# EasyEDA schematic SCH_电工电子实习_2022-11-09.json
TITLE: 原理图; REV: 1.0; Date: 2022-11-9; Sheet: 1/1; Drawn By: 物联214柳栓柱; Company: Your Company
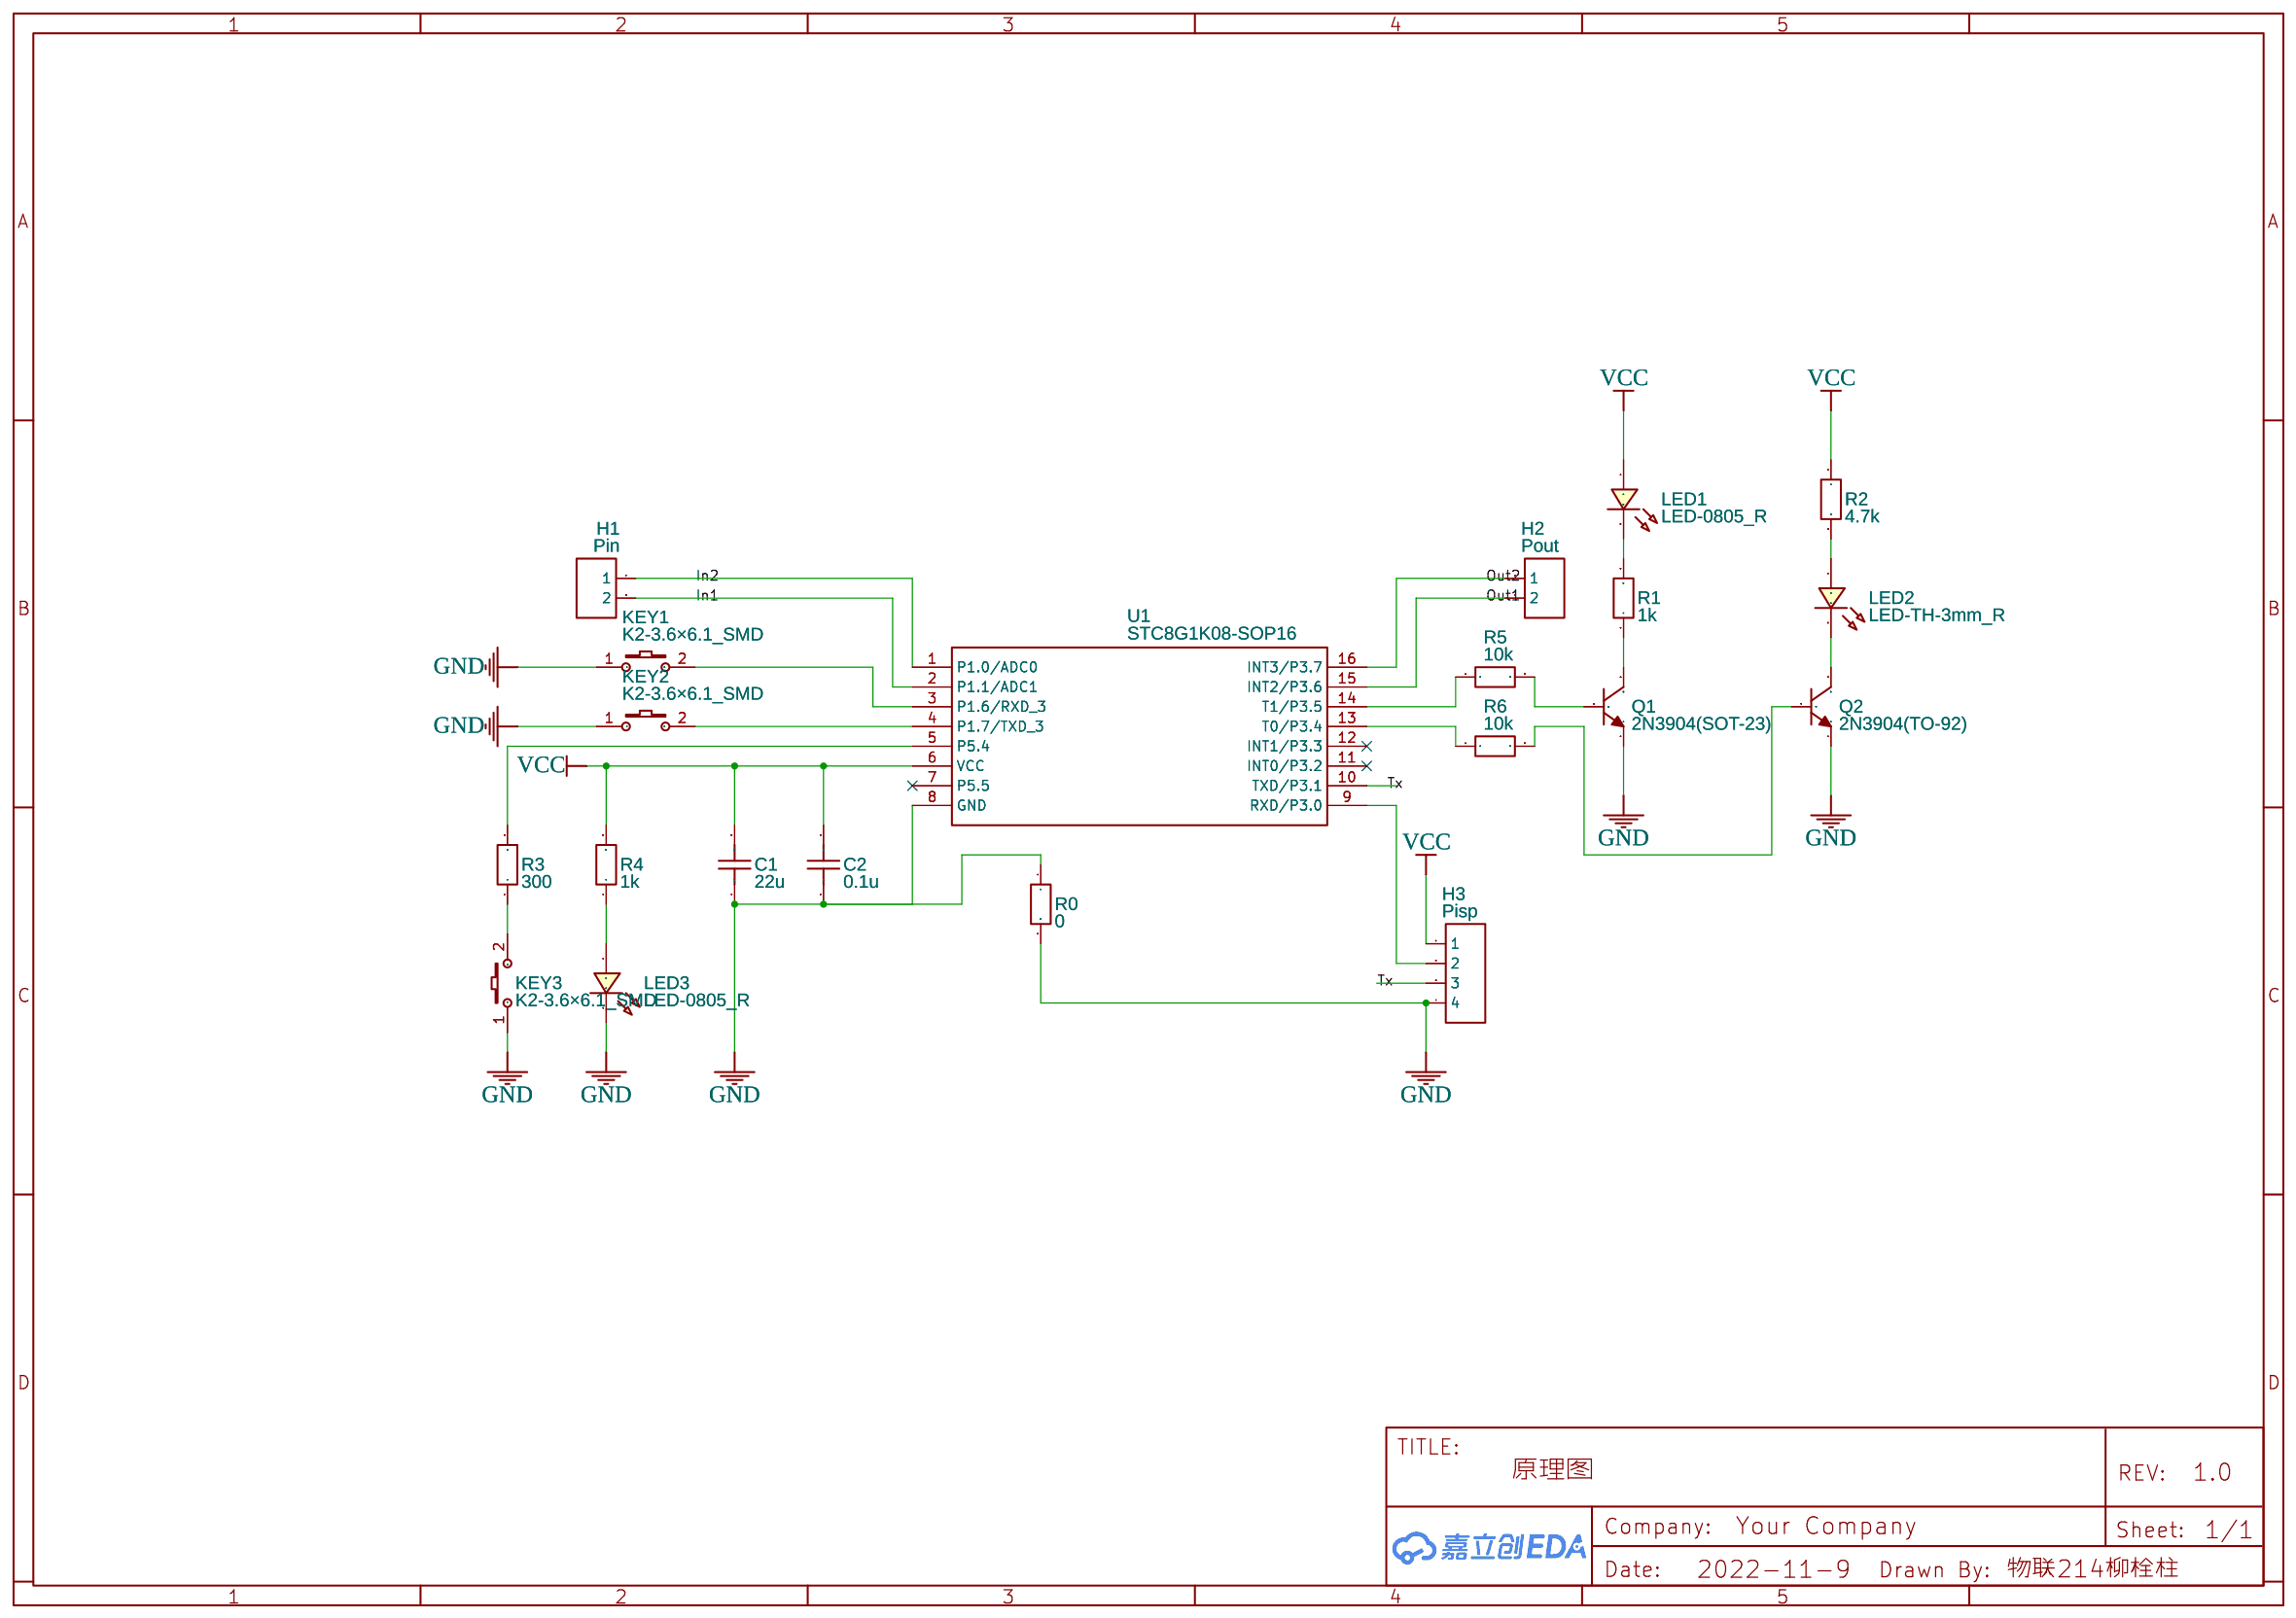
[diagram p0: schematic sheet]

## Parts
C1  22u  [C0805]
C2  0.1u  [C0805]
H1  Pin  [HDR-M-2.54_1X2]
H2  Pout  [HDR-M-2.54_1X2]
H3  Pisp  [HDR-M-2.54_1X4]
KEY1  K2-3.6×6.1_SMD  [KEY-SMD_2P-L6.2-W3.6-LS8.0]
KEY2  K2-3.6×6.1_SMD  [KEY-SMD_2P-L6.2-W3.6-LS8.0]
KEY3  K2-3.6×6.1_SMD  [KEY-SMD_2P-L6.2-W3.6-LS8.0]
LED1  LED-0805_R  [LED0805_RED]
LED2  LED-TH-3mm_R  [LED-TH_BD3.0_RED]
LED3  LED-0805_R  [LED0805_RED]
Q1  2N3904(SOT-23)  [SOT-23-3_L2.9-W1.3-P1.90-LS2.4-TR]
Q2  2N3904(TO-92)  [TO-92-3_L5.1-W4.1-P1.27-L]
R0  0  [R_AXIAL-0.3]
R1  1k  [R0805]
R2  4.7k  [R_AXIAL-0.3]
R3  300  [R0805]
R4  1k  [R0805]
R5  10k  [R0805]
R6  10k  [R_AXIAL-0.3]
U1  STC8G1K08-SOP16  [SOP16]

## Library data of the parts
C1 C2 = C_0603_US: Contributor: LCEDA_Lib
H1 H2 = HDR-F-2.54_1x2: Supplier Part: C49661; Supplier: LCSC; Contributor: LCEDA_Lib
H3 = HDR-F-2.54_1x4: Supplier Part: C225501; Supplier: LCSC; Contributor: LCEDA_Lib
KEY1-KEY3 = K2-3.6×6.1_SMD: Supplier Part: C118141; Supplier: LCSC; Manufacturer Part: K2-1107ST-A4SW-06; Contributor: LCEDA_Lib; 制造商: 韩国韩荣
LED1 LED3 = LED-0805_R: Manufacturer: EVERLIGHT(台湾亿光); Manufacturer Part: 17-21SURC/S530-A3/TR8; Supplier Part: C72037; Contributor: LCEDA_Lib
LED2 = LED-TH-3mm_R: Manufacturer: EVERLIGHT(台湾亿光); Manufacturer Part: 204-10SDRD/S530-A3-L; Supplier Part: C84774; Supplier: LCSC; Contributor: LCEDA_Lib
Q1 = 2N3904(SOT-23): Supplier: LCSC; Manufacturer: KEC; Manufacturer Part: 2n3904S-RTK/PS; Supplier Part: C18536; Paste Type: SOT-23; Contributor: LCEDA_Lib
Q2 = 2N3904(TO-92): Supplier: LCSC; Manufacturer: SEMTECH; Manufacturer Part: 2N3904; Supplier Part: C118538; Contributor: LCEDA_Lib
R0-R6 = R_0603_EU: Contributor: LCEDA_Lib
U1 = STC8G1K08-SOP16: Manufacturer: STC; Supplier: LCSC; Contributor: apple_01

## Nets
GND: C1.1 C2.1 H3.4 KEY1.1 KEY2.1 KEY3.1 LED3.2 Q1.1(E) Q2.1(E) R0.1 R0.2 U1.8(GND)
VCC: C1.2 C2.2 H3.1 LED1.1 R2.1 R4.2 U1.6(VCC)
In1: H1.2 U1.2(P1.1/ADC1)
In2: H1.1 U1.1(P1.0/ADC0)
Out1: H2.2 U1.15(INT2/P3.6)
Out2: H2.1 U1.16(INT3/P3.7)
Tx: H3.3 U1.10(TXD/P3.1)
Net-(H3-2): H3.2 U1.9(RXD/P3.0)
Net-(KEY1-2): KEY1.2 U1.3(P1.6/RXD)
Net-(KEY2-2): KEY2.2 U1.4(P1.7/TXD_3)
Net-(KEY3-2): KEY3.2 R3.1
Net-(LED1-2): LED1.2 R1.2
Net-(LED2-1): LED2.1 R2.2
Net-(LED2-2): LED2.2 Q2.3(C)
Net-(LED3-1): LED3.1 R4.1
Net-(Q1-2): Q1.2(B) R5.2
Net-(Q1-3): Q1.3(C) R1.1
Net-(Q2-2): Q2.2(B) R6.2
Net-(R3-2): R3.2 U1.5(P5.4)
Net-(R5-1): R5.1 U1.14(T1/P3.5)
Net-(R6-1): R6.1 U1.13(T0/P3.4)

Not connected (* = marked no-connect by the designer): U1 7(P5.5)* 11(INT0/P3.2)* 12(INT1/P3.3)*
